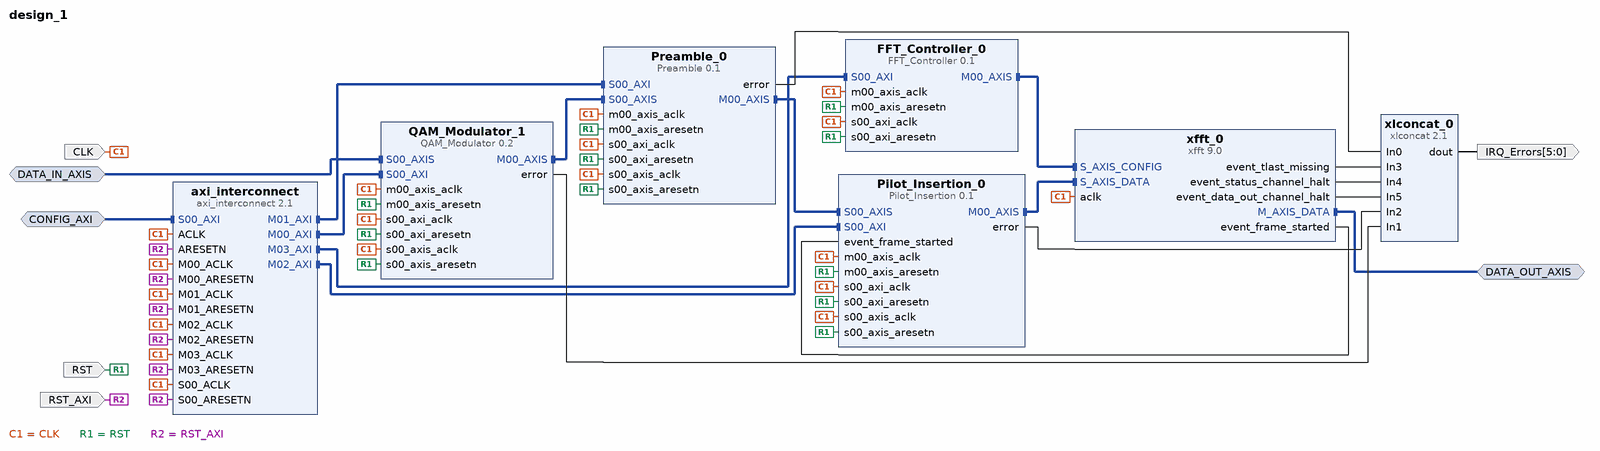
[diagram p0: block diagram of the top level]
# Vivado block design design_1, xc7z020clg484-1, Vivado 2016.4
create_bd_design design_1

create_bd_intf_port -mode Slave -vlnv xilinx.com:interface:aximm_rtl:1.0 CONFIG_AXI
set_property -dict [list \
  CONFIG.DATA_WIDTH 32 \
  CONFIG.PROTOCOL AXI4LITE \
  CONFIG.ID_WIDTH 0 \
  CONFIG.ADDR_WIDTH 14 \
  CONFIG.AWUSER_WIDTH 0 \
  CONFIG.ARUSER_WIDTH 0 \
  CONFIG.WUSER_WIDTH 0 \
  CONFIG.RUSER_WIDTH 0 \
  CONFIG.BUSER_WIDTH 0 \
  CONFIG.READ_WRITE_MODE READ_WRITE \
  CONFIG.HAS_BURST 0 \
  CONFIG.HAS_LOCK 0 \
  CONFIG.HAS_PROT 1 \
  CONFIG.HAS_CACHE 0 \
  CONFIG.HAS_QOS 0 \
  CONFIG.HAS_REGION 0 \
  CONFIG.HAS_WSTRB 1 \
  CONFIG.HAS_BRESP 1 \
  CONFIG.HAS_RRESP 1 \
  CONFIG.SUPPORTS_NARROW_BURST 0 \
  CONFIG.NUM_READ_OUTSTANDING 1 \
  CONFIG.NUM_WRITE_OUTSTANDING 1 \
  CONFIG.MAX_BURST_LENGTH 1 \
  CONFIG.NUM_READ_THREADS 1 \
  CONFIG.NUM_WRITE_THREADS 1 \
  CONFIG.RUSER_BITS_PER_BYTE 0 \
  CONFIG.WUSER_BITS_PER_BYTE 0 \
] [get_bd_intf_ports CONFIG_AXI]
create_bd_intf_port -mode Slave -vlnv xilinx.com:interface:axis_rtl:1.0 DATA_IN_AXIS
set_property -dict [list \
  CONFIG.TDATA_NUM_BYTES 4 \
  CONFIG.TDEST_WIDTH 0 \
  CONFIG.TID_WIDTH 0 \
  CONFIG.TUSER_WIDTH 0 \
  CONFIG.HAS_TREADY 1 \
  CONFIG.HAS_TSTRB 0 \
  CONFIG.HAS_TKEEP 0 \
  CONFIG.HAS_TLAST 0 \
  CONFIG.LAYERED_METADATA undef \
] [get_bd_intf_ports DATA_IN_AXIS]
create_bd_intf_port -mode Master -vlnv xilinx.com:interface:axis_rtl:1.0 DATA_OUT_AXIS
create_bd_port -dir I -type clk CLK
set_property -dict [list \
  CONFIG.FREQ_HZ 100000000 \
  CONFIG.ASSOCIATED_BUSIF DATA_IN_AXIS:CONFIG_AXI:DATA_OUT_AXIS \
  CONFIG.ASSOCIATED_RESET RST_AXI:RST \
] [get_bd_ports CLK]
create_bd_port -dir I -type rst RST
set_property -dict {CONFIG.POLARITY ACTIVE_LOW} [get_bd_ports RST]
create_bd_port -dir I -type rst RST_AXI
set_property -dict {CONFIG.POLARITY ACTIVE_LOW} [get_bd_ports RST_AXI]
create_bd_port -dir O -from 5 -to 0 IRQ_Errors

create_bd_cell -type ip -vlnv xilinx.com:ip:axi_interconnect:2.1 axi_interconnect
set_property -dict {CONFIG.NUM_MI 4} [get_bd_cells axi_interconnect]
create_bd_cell -type ip -vlnv xilinx.com:ip:xfft:9.0 xfft_0
set_property -dict [list \
  CONFIG.transform_length 512 \
  CONFIG.implementation_options pipelined_streaming_io \
  CONFIG.run_time_configurable_transform_length true \
  CONFIG.data_format fixed_point \
  CONFIG.scaling_options scaled \
  CONFIG.xk_index true \
  CONFIG.throttle_scheme nonrealtime \
  CONFIG.output_ordering natural_order \
  CONFIG.cyclic_prefix_insertion true \
  CONFIG.number_of_stages_using_block_ram_for_data_and_phase_factors 2 \
] [get_bd_cells xfft_0]
create_bd_cell -type ip -vlnv user.org:user:Preamble:0.1 Preamble_0
create_bd_cell -type ip -vlnv user.org:user:FFT_Controller:0.1 FFT_Controller_0
create_bd_cell -type ip -vlnv user.org:user:Pilot_Insertion:0.1 Pilot_Insertion_0
create_bd_cell -type ip -vlnv xilinx.com:ip:xlconcat:2.1 xlconcat_0
set_property -dict {CONFIG.NUM_PORTS 6} [get_bd_cells xlconcat_0]
create_bd_cell -type ip -vlnv user.org:user:QAM_Modulator:0.2 QAM_Modulator_1

# ---- connections ----

connect_bd_intf_net [get_bd_intf_pins Preamble_0/S00_AXI] [get_bd_intf_pins axi_interconnect/M01_AXI]
connect_bd_intf_net [get_bd_intf_pins Preamble_0/M00_AXIS] [get_bd_intf_pins Pilot_Insertion_0/S00_AXIS]
connect_bd_intf_net [get_bd_intf_pins Pilot_Insertion_0/S00_AXI] [get_bd_intf_pins axi_interconnect/M02_AXI]
connect_bd_intf_net [get_bd_intf_pins FFT_Controller_0/M00_AXIS] [get_bd_intf_pins xfft_0/S_AXIS_CONFIG]
connect_bd_intf_net [get_bd_intf_pins FFT_Controller_0/S00_AXI] [get_bd_intf_pins axi_interconnect/M03_AXI]
connect_bd_intf_net [get_bd_intf_pins QAM_Modulator_1/S00_AXI] [get_bd_intf_pins axi_interconnect/M00_AXI]
connect_bd_intf_net [get_bd_intf_pins QAM_Modulator_1/M00_AXIS] [get_bd_intf_pins Preamble_0/S00_AXIS]
connect_bd_intf_net [get_bd_intf_pins Pilot_Insertion_0/M00_AXIS] [get_bd_intf_pins xfft_0/S_AXIS_DATA]
connect_bd_intf_net [get_bd_intf_ports CONFIG_AXI] [get_bd_intf_pins axi_interconnect/S00_AXI]
connect_bd_intf_net [get_bd_intf_ports DATA_IN_AXIS] [get_bd_intf_pins QAM_Modulator_1/S00_AXIS]
connect_bd_intf_net [get_bd_intf_ports DATA_OUT_AXIS] [get_bd_intf_pins xfft_0/M_AXIS_DATA]
connect_bd_net -net processing_system7_0_FCLK_CLK0 [get_bd_ports CLK] \
  [get_bd_pins xfft_0/aclk] [get_bd_pins Preamble_0/m00_axis_aclk] [get_bd_pins Preamble_0/s00_axis_aclk] \
  [get_bd_pins Preamble_0/s00_axi_aclk] [get_bd_pins FFT_Controller_0/s00_axi_aclk] \
  [get_bd_pins FFT_Controller_0/m00_axis_aclk] [get_bd_pins Pilot_Insertion_0/m00_axis_aclk] \
  [get_bd_pins Pilot_Insertion_0/s00_axis_aclk] [get_bd_pins Pilot_Insertion_0/s00_axi_aclk] \
  [get_bd_pins axi_interconnect/ACLK] [get_bd_pins axi_interconnect/S00_ACLK] [get_bd_pins axi_interconnect/M00_ACLK] \
  [get_bd_pins axi_interconnect/M01_ACLK] [get_bd_pins axi_interconnect/M02_ACLK] [get_bd_pins axi_interconnect/M03_ACLK] \
  [get_bd_pins QAM_Modulator_1/s00_axi_aclk] [get_bd_pins QAM_Modulator_1/s00_axis_aclk] \
  [get_bd_pins QAM_Modulator_1/m00_axis_aclk]
connect_bd_net -net ARESETN_1 [get_bd_ports RST] \
  [get_bd_pins Preamble_0/m00_axis_aresetn] [get_bd_pins Preamble_0/s00_axis_aresetn] \
  [get_bd_pins Preamble_0/s00_axi_aresetn] [get_bd_pins FFT_Controller_0/s00_axi_aresetn] \
  [get_bd_pins FFT_Controller_0/m00_axis_aresetn] [get_bd_pins Pilot_Insertion_0/m00_axis_aresetn] \
  [get_bd_pins Pilot_Insertion_0/s00_axis_aresetn] [get_bd_pins Pilot_Insertion_0/s00_axi_aresetn] \
  [get_bd_pins QAM_Modulator_1/s00_axi_aresetn] [get_bd_pins QAM_Modulator_1/s00_axis_aresetn] \
  [get_bd_pins QAM_Modulator_1/m00_axis_aresetn]
connect_bd_net [get_bd_pins xfft_0/event_frame_started] [get_bd_pins Pilot_Insertion_0/event_frame_started]
connect_bd_net -net ARESETN_2 [get_bd_ports RST_AXI] \
  [get_bd_pins axi_interconnect/ARESETN] [get_bd_pins axi_interconnect/S00_ARESETN] \
  [get_bd_pins axi_interconnect/M00_ARESETN] [get_bd_pins axi_interconnect/M01_ARESETN] \
  [get_bd_pins axi_interconnect/M02_ARESETN] [get_bd_pins axi_interconnect/M03_ARESETN]
connect_bd_net [get_bd_pins Preamble_0/error] [get_bd_pins xlconcat_0/In0]
connect_bd_net [get_bd_pins QAM_Modulator_1/error] [get_bd_pins xlconcat_0/In1]
connect_bd_net [get_bd_pins Pilot_Insertion_0/error] [get_bd_pins xlconcat_0/In2]
connect_bd_net [get_bd_pins xfft_0/event_tlast_missing] [get_bd_pins xlconcat_0/In3]
connect_bd_net [get_bd_pins xfft_0/event_status_channel_halt] [get_bd_pins xlconcat_0/In4]
connect_bd_net [get_bd_pins xfft_0/event_data_out_channel_halt] [get_bd_pins xlconcat_0/In5]
connect_bd_net [get_bd_pins xlconcat_0/dout] [get_bd_ports IRQ_Errors]

# ---- address map ----
assign_bd_address -offset 0x0000 -range 4K -target_address_space [get_bd_addr_spaces CONFIG_AXI] [get_bd_addr_segs Preamble_0/S00_AXI/S00_AXI_reg]
assign_bd_address -offset 0x1000 -range 4K -target_address_space [get_bd_addr_spaces CONFIG_AXI] [get_bd_addr_segs QAM_Modulator_1/S00_AXI/S00_AXI_reg]
assign_bd_address -offset 0x2000 -range 4K -target_address_space [get_bd_addr_spaces CONFIG_AXI] [get_bd_addr_segs Pilot_Insertion_0/S00_AXI/S00_AXI_reg]
assign_bd_address -offset 0x3000 -range 4K -target_address_space [get_bd_addr_spaces CONFIG_AXI] [get_bd_addr_segs FFT_Controller_0/S00_AXI/S00_AXI_reg]

validate_bd_design
save_bd_design
